# Altium schematic sheet Controller_Board_Interface.SchDoc
size Letter; Organization: Midnight Sun Solar Rayce Car Team; Address1: University of Waterloo; Address2: 200 University Ave W; Address3: Waterloo, ON, Canada; Address4: N2L 3E9; Website: www.uwmidsun.com
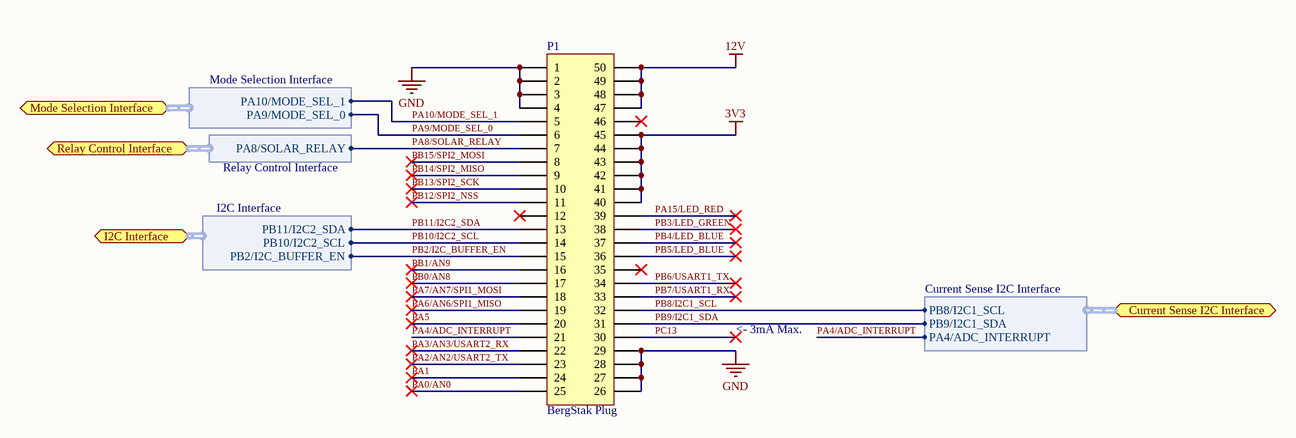
[diagram p0: Controller_Board_Interface.SchDoc]

## Parts
P1  Series: BergStak Plug  [CONN, Bergstak 50 Pos Plug]  (hidden comment: CONN 50POS Bergstak Plug 0.02")

## Ports
Current Sense I2C Interface (harness Current Sense I2C Interface), I2C Interface (harness I2C Interface), Mode Selection Interface (harness Mode Selection Interface), Relay Control Interface (harness Relay Control Interface)

## Harnesses
I2C Interface: PB10/I2C2_SCL, PB11/I2C2_SDA, PB2/I2C_BUFFER_EN
Relay Control Interface: PA8/SOLAR_RELAY
Current Sense I2C Interface: PB8/I2C1_SCL, PB9/I2C1_SDA, PA4/ADC_INTERRUPT
Mode Selection Interface: PA9/MODE_SEL_0, PA10/MODE_SEL_1

## Nets
3V3: P1.40 P1.41 P1.42 P1.43 P1.44 P1.45
12V: P1.47 P1.48 P1.49 P1.50
GND: P1.1 P1.2 P1.3 P1.4 P1.26 P1.27 P1.28 P1.29
PA0/AN0: P1.25
PA1: P1.24
PA2/AN2/USART2_TX: P1.23
PA3/AN3/USART2_RX: P1.22
PA4/ADC_INTERRUPT: P1.21 ; port Current Sense I2C Interface.PA4/ADC_INTERRUPT
PA5: P1.20
PA6/AN6/SPI1_MISO: P1.19
PA7/AN7/SPI1_MOSI: P1.18
PA8/SOLAR_RELAY: P1.7 ; port Relay Control Interface.PA8/SOLAR_RELAY
PA9/MODE_SEL_0: P1.6 ; port Mode Selection Interface.PA9/MODE_SEL_0
PA10/MODE_SEL_1: P1.5 ; port Mode Selection Interface.PA10/MODE_SEL_1
PA15/LED_RED: P1.39
PB0/AN8: P1.17
PB1/AN9: P1.16
PB2/I2C_BUFFER_EN: P1.15 ; port I2C Interface.PB2/I2C_BUFFER_EN
PB3/LED_GREEN: P1.38
PB4/LED_BLUE: P1.37
PB5/LED_BLUE: P1.36
PB6/USART1_TX: P1.34
PB7/USART1_RX: P1.33
PB8/I2C1_SCL: P1.32 ; port Current Sense I2C Interface.PB8/I2C1_SCL
PB9/I2C1_SDA: P1.31 ; port Current Sense I2C Interface.PB9/I2C1_SDA
PB10/I2C2_SCL: P1.14 ; port I2C Interface.PB10/I2C2_SCL
PB11/I2C2_SDA: P1.13 ; port I2C Interface.PB11/I2C2_SDA
PB12/SPI2_NSS: P1.11
PB13/SPI2_SCK: P1.10
PB14/SPI2_MISO: P1.9
PB15/SPI2_MOSI: P1.8
PC13: P1.30

Not connected (* = marked no-connect by the designer): P1 12* 35* 46*

## Notes on the sheet
- <- 3mA Max.
- Project:
- Title:
- Size:
- Project Author
- Letter
- Revision:
- University of Waterloo
- 200 University Ave W
- Waterloo, ON, Canada
- N2L 3E9
- Date:
- Sheet
- of
- Website:

## Library data of the parts
P1 = CONN 50POS Bergstak Plug 0.02": 50 Position Connector Plug, Outer Shroud Contacts Surface Mount Gold; Manufacturer 1: Amphenol FCI; Manufacturer Part Number 1: 10132797-055100LF; Number of Positions: 50; Mated Stacking Heights: 5mm; Pitch: 0.020" (0.50mm); Supplier 1: Digi-Key; Supplier Part Number 1: 609-5226-1-ND; Packaging: Cut Tape (CT); Part Status: Active; Connector Type: Plug, Outer Shroud Contacts; Number of Rows: 2; Mounting Type: Surface Mount; Contact Finish: Gold; Contact Finish Thickness: 1µin (0.025µm); Height Above Board: 0.169" (4.30mm); ComponentLink1URL: http://portal.fciconnect.com/Comergent//fci/drawing/10132797.pdf; ComponentLink1Description: http://portal.fciconnect.com/Comergent//fci/drawing/10132797.pdf